# Altium schematic sheet RFID_DC_Motor_Stm32.SchDoc
size A4
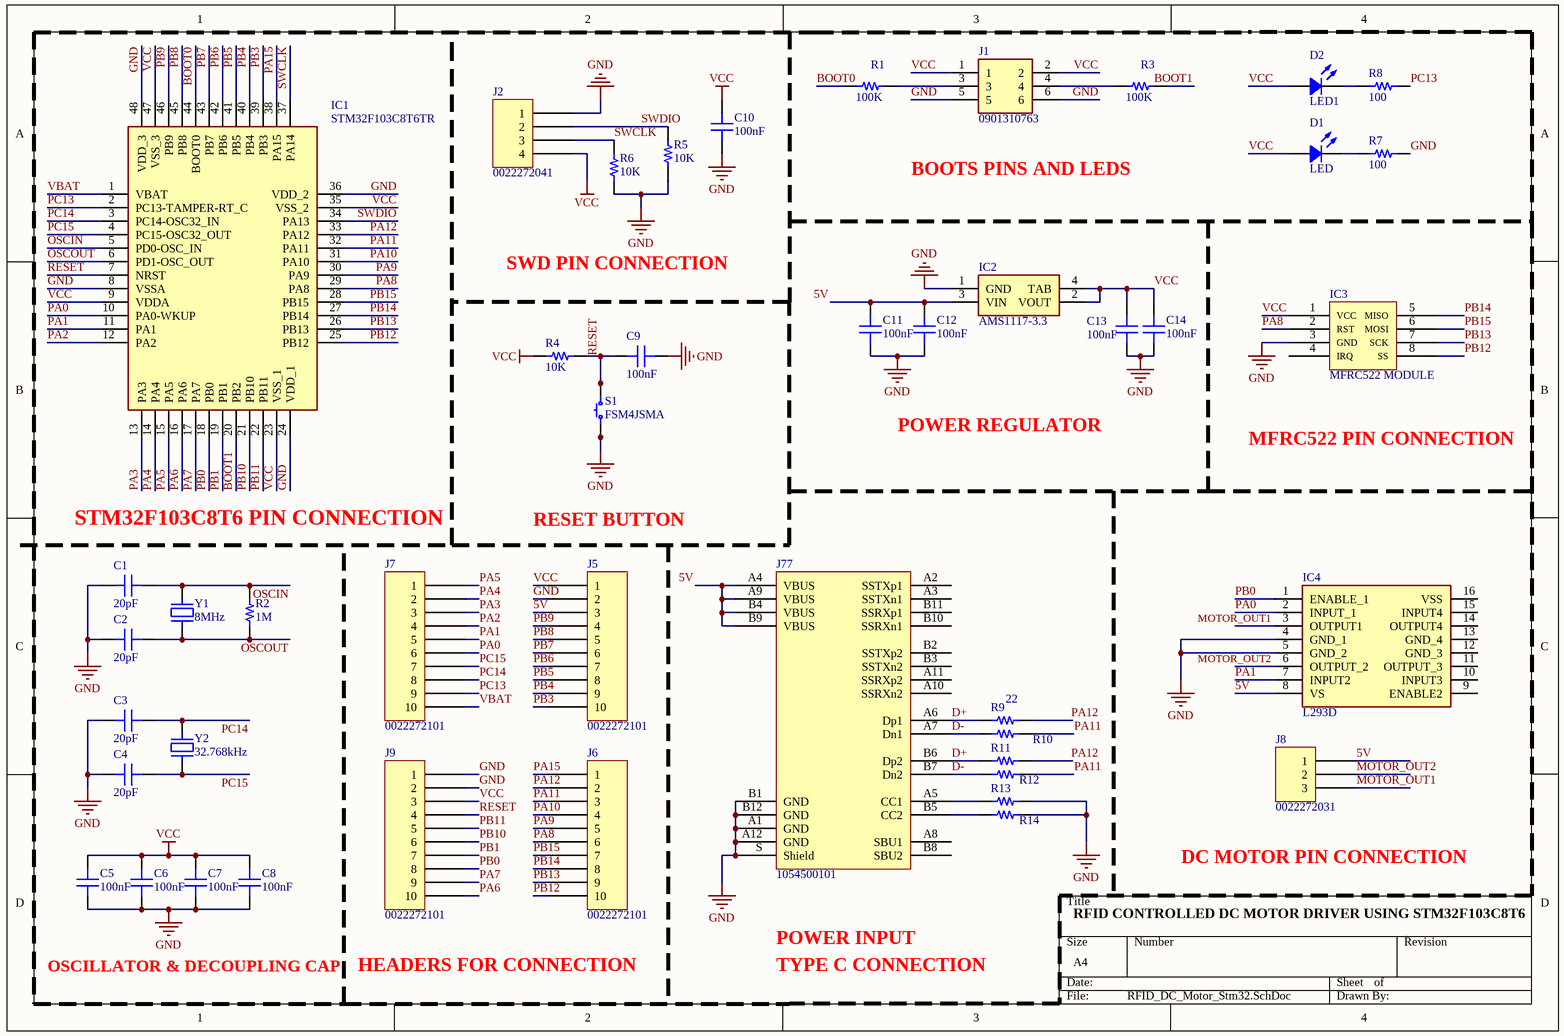
[diagram p0: RFID_DC_Motor_Stm32.SchDoc]

## Parts
C1  20pF  [CAP 0805_2012]
C2  20pF  [CAP 0805_2012]
C3  20pF  [CAP 0805_2012]
C4  20pF  [CAP 0805_2012]
C5  100nF  [CAP 0805_2012]
C6  100nF  [CAP 0805_2012]
C7  100nF  [CAP 0805_2012]
C8  100nF  [CAP 0805_2012]
C9  100nF  [CAP 0805_2012]
C10  100nF  [CAP 0805_2012]
C11  100nF  [CAP 0805_2012]
C12  100nF  [CAP 0805_2012]
C13  100nF  [CAP 0805_2012]
C14  100nF  [CAP 0805_2012]
D1  LED  [CREE J 2835]
D2  LED1  [CREE J 2835]
IC1  STM32F103C8T6TR  [QFP50P900X900X160-48N]
IC2  AMS1117-3.3  [SOT229P700X180-4N]
IC3  MFRC522 MODULE  [RC522]
IC4  L293D  [DIP880W50P254L2000H510Q16N]
J1  0901310763  [HDRV6W90P254_2X3_762X500X560P]
J2  0022272041  [MOLEX KK 0022272041]
J5  0022272101  [MOLEX KK 0022272101]
J6  0022272101  [MOLEX KK 0022272101]
J7  0022272101  [MOLEX KK 0022272101]
J8  0022272031  [MOLEX KK 0022272031]
J9  0022272101  [MOLEX KK 0022272101]
J77  1054500101  [Molex 1054500101]
R1  100K  [RES 0805_2012]
R2  1M  [RES 0805_2012]
R3  100K  [RES 0805_2012]
R4  10K  [RES 0805_2012]
R5  10K  [RES 0805_2012]
R6  10K  [RES 0805_2012]
R7  100  [RES 0805_2012]
R8  100  [RES 0805_2012]
R9  22  [RES 0805_2012]
R10  (no value)  [RES 0805_2012]
R11  (no value)  [RES 0805_2012]
R12  (no value)  [RES 0805_2012]
R13  (no value)  [RES 0805_2012]
R14  (no value)  [RES 0805_2012]
S1  FSM4JSMA  [TE FSM4JSMA]
Y1  8MHz  [ABRACON ABLS]
Y2  32.768kHz  [ABRACON ABS07]

## Nets
GND: C1.1 C2.1 C3.1 C4.1 C5.1 C6.1 C7.1 C8.1 C9.1 C10.1 C11.1 C12.1 C13.1 C14.1 IC1.8(VSSA) IC1.24(VDD_1) IC1.36(VDD_2) IC1.48(VDD_3) IC2.1(GND) IC3.3(GND) IC4.4(GND_1) IC4.5(GND_2) J1.5 J1.6 J2.1 J5.2 J9.1 J9.2 J77.A1(GND) J77.A12(GND) J77.B1(GND) J77.B12(GND) J77.S(Shield) R5.1 R6.2 R7.2 R13.1 R14.1 S1.1 S1.2
VCC: C5.2 C6.2 C7.2 C8.2 C10.2 C13.2 C14.2 D1.1 D2.1 IC1.9(VDDA) IC1.23(VSS_1) IC1.35(VSS_2) IC1.47(VSS_3) IC2.2(VOUT) IC2.4(TAB) IC3.1(VCC) J1.1 J1.2 J2.4 J5.1 J9.3 R4.2
5V: C11.2 C12.2 IC2.3(VIN) IC4.8(VS) J5.3 J8.1 J77.A4(VBUS) J77.A9(VBUS) J77.B4(VBUS) J77.B9(VBUS)
BOOT0: IC1.44(BOOT0) R1.1
BOOT1: IC1.20(PB2) R3.2
D+: J77.A6(Dp1) J77.B6(Dp2) R9.2 R11.2
D-: J77.A7(Dn1) J77.B7(Dn2) R10.2 R12.2
MOTOR_OUT1: IC4.3(OUTPUT1) J8.3
MOTOR_OUT2: IC4.6(OUTPUT_2) J8.2
OSCIN: C1.2 IC1.5(PD0-OSC_IN) R2.2 Y1.2
OSCOUT: C2.2 IC1.6(PD1-OSC_OUT) R2.1 Y1.1
PA0: IC1.10(PA0-WKUP) IC4.2(INPUT_1) J7.6
PA1: IC1.11(PA1) IC4.7(INPUT2) J7.5
PA2: IC1.12(PA2) J7.4
PA3: IC1.13(PA3) J7.3
PA4: IC1.14(PA4) J7.2
PA5: IC1.15(PA5) J7.1
PA6: IC1.16(PA6) J9.10
PA7: IC1.17(PA7) J9.9
PA8: IC1.29(PA8) IC3.2(RST) J6.6
PA9: IC1.30(PA9) J6.5
PA10: IC1.31(PA10) J6.4
PA11: IC1.32(PA11) J6.3 R10.1 R12.1
PA12: IC1.33(PA12) J6.2 R9.1 R11.1
PA15: IC1.38(PA15) J6.1
PB0: IC1.18(PB0) IC4.1(ENABLE_1) J9.8
PB1: IC1.19(PB1) J9.7
PB3: IC1.39(PB3) J5.10
PB4: IC1.40(PB4) J5.9
PB5: IC1.41(PB5) J5.8
PB6: IC1.42(PB6) J5.7
PB7: IC1.43(PB7) J5.6
PB8: IC1.45(PB8) J5.5
PB9: IC1.46(PB9) J5.4
PB10: IC1.21(PB10) J9.6
PB11: IC1.22(PB11) J9.5
PB12: IC1.25(PB12) IC3.8(SS) J6.10
PB13: IC1.26(PB13) IC3.7(SCK) J6.9
PB14: IC1.27(PB14) IC3.5(MISO) J6.8
PB15: IC1.28(PB15) IC3.6(MOSI) J6.7
PC13: IC1.2(PC13-TAMPER-RT_C) J7.9 R8.2
PC14: C3.2 IC1.3(PC14-OSC32_IN) J7.8 Y2.1
PC15: C4.2 IC1.4(PC15-OSC32_OUT) J7.7 Y2.2
RESET: C9.2 IC1.7(NRST) J9.4 R4.1 S1.3 S1.4
SWCLK: IC1.37(PA14) J2.3 R6.1
SWDIO: IC1.34(PA13) J2.2 R5.2
VBAT: IC1.1(VBAT) J7.10
NetD1_2: D1.2 R7.1
NetD2_2: D2.2 R8.1
NetJ1_3: J1.3 R1.2
NetJ1_4: J1.4 R3.1
NetJ77_A5: J77.A5(CC1) R13.2
NetJ77_B5: J77.B5(CC2) R14.2

Not connected (* = marked no-connect by the designer): IC3 4(IRQ); IC4 9(ENABLE2) 10(INPUT3) 11(OUTPUT_3) 12(GND_3) 13(GND_4) 14(OUTPUT4) 15(INPUT4) 16(VSS); J77 A2(SSTXp1) A3(SSTXn1) A8(SBU1) A10(SSRXn2) A11(SSRXp2) B2(SSTXp2) B3(SSTXn2) B8(SBU2) B10(SSRXn1) B11(SSRXp1)

## Notes on the sheet
- BOOTS PINS AND LEDS
- SWD PIN CONNECTION
- POWER REGULATOR
- MFRC522 PIN CONNECTION
- STM32F103C8T6 PIN CONNECTION
- RESET BUTTON
- RFID CONTROLLED DC MOTOR DRIVER USING STM32F103C8T6
- DC MOTOR PIN CONNECTION
- OSCILLATOR & DECOUPLING CAP
- HEADERS FOR CONNECTION
- TYPE C CONNECTION
- POWER INPUT

## Library data of the parts
C1-C14 = C0805C104M4VACTU: CAP CER 0.1UF 16V Y5V 0805; Manufacturer: KEMET; Capacitance: 0.1µF; Temperature Coefficient: Y5V (F); Tolerance: ±20%; Part Number: C0805C104M4VACTU; Applications: General Purpose; ComponentLink1Description: Datasheet; ComponentLink1URL: https://api.kemet.com/component-edge/download/datasheet/C0805C104M4VACTU.pdf; ComponentLink2Description: DigiKey Link; ComponentLink2URL: http://digikey.com/product-detail/en/kemet/C0805C104M4VACTU/399-9156-1-ND/3522674; Device Package: 0805 (2012 Metric); LastUpdated: 2.09.2020 01:04:38; Lifecycle Status: Active; Minimum Order: 1; Mounting Type: Surface Mount, MLCC; Operating Temperature: -30°C ~ 85°C; Package / Case: 0805 (2012 Metric); Packaging: TapeAndReel; PartId: 4429; Part Status: Active; Price: 0.02; Series: SMD Comm Y5V; Size / Dimension: 0.079" L x 0.049" W (2.00mm x 1.25mm); Supplier 1: DigiKey; Supplier Part Number 1: 399-9156-1-ND; Thickness (Max): 0.035" (0.88mm); Voltage - Rated: 16V
  C1-C4: Value: 20pF
  C5-C14: Value: 100nF
D1 D2 = JE2835AWT-R-U40GA0000-N0000001: LED WHITE  4000K JE2835 3V; Manufacturer: Cree Inc.; CCT (K): 4000K 3-Step MacAdam Ellipse; CRI (Color Rendering Index): 90; Current - Max: 240mA; Current - Test: 150mA; Flux @ 25°C, Current - Test: 62lm (Typ); Flux @ 85°C, Current - Test: 53lm (Typ); Lumens/Watt @ Current - Test: 140 lm/W; Viewing Angle: 120°; Voltage - Forward (Vf) (Typ): 2.95V; Part Number: JE2835AWT-R-U40GA0000-N0000001; ComponentLink1Description: Datasheet; ComponentLink1URL: https://www.cree.com/led-components/media/documents/data-sheet-JSeries-2835-3v.pdf; ComponentLink2Description: DigiKey Link; ComponentLink2URL: http://digikey.com/product-detail/en/cree-inc/JE2835AWT-R-U40GA0000-N0000001/2138-JE2835AWT-R-U40GA0000-N0000001CT-ND/10820356; Device Package: 1113 (2835 Metric); LastUpdated: 2.09.2020 01:30:24; Lifecycle Status: Active; Minimum Order: 1; Mounting Type: Surface Mount; Package / Case: 1113 (2835 Metric); Packaging: TapeAndReel; PartId: 58; Part Status: 1113 (2835 Metric); Price: 0.02; Series: J; Supplier 1: DigiKey; Supplier Part Number 1: 2138-JE2835AWT-R-U40GA0000-N0000001CT-ND; Supplier Device Package: SMD
IC1 = STM32F103C8T6TR: Integrated Circuit; Manufacturer_Name: STMicroelectronics; Datasheet Link: http://media.digikey.com/pdf/Data%20Sheets/ST%20Microelectronics%20PDFS/STM32F103x8,B.pdf; Height: 1.6mm; Manufacturer_Part_Number: STM32F103C8T6TR; Mouser Part Number: 511-STM32F103C8T6TR; Mouser Price/Stock: https://www.mouser.co.uk/ProductDetail/STMicroelectronics/STM32F103C8T6TR?qs=5HwTSiuA5HDxFj62n06yag%3D%3D; Arrow Part Number: STM32F103C8T6TR; Arrow Price/Stock: https://www.arrow.com/en/products/stm32f103c8t6tr/stmicroelectronics
IC2 = AMS1117-3.3: Integrated Circuit; Manufacturer_Name: Advanced Monolithic Systems; Datasheet Link: http://www.advanced-monolithic.com/pdf/ds1117.pdf; Height: 1.8mm; Manufacturer_Part_Number: AMS1117-3.3
IC3 = MFRC522 MODULE: RFID MODULE
IC4 = L293D: Integrated Circuit; Manufacturer_Name: STMicroelectronics; Datasheet Link: http://www.st.com/web/en/resource/technical/document/datasheet/CD00000059.pdf; Height: 5.1mm; Manufacturer_Part_Number: L293D; Mouser Part Number: 511-L293D; Mouser Price/Stock: https://www.mouser.co.uk/ProductDetail/STMicroelectronics/L293D/?qs=gr8Zi5OG3MgMJ1ICDzLQbg%3D%3D; Arrow Part Number: L293D; Arrow Price/Stock: https://www.arrow.com/en/products/l293d/stmicroelectronics
J1 = 0901310763: Connector; Manufacturer_Name: Molex; Datasheet Link: http://www.molex.com/pdm_docs/sd/901310763_sd.pdf; Height: 5.6mm; Manufacturer_Part_Number: 0901310763; Mouser Part Number: N/A; Mouser Price/Stock: https://www.mouser.co.uk/ProductDetail/Molex/0901310763?qs=PBcRNPEHKsoEorZjX1Xqdw%3D%3D; Arrow Part Number: 0901310763; Arrow Price/Stock: https://www.arrow.com/en/products/0901310763/molex
J2 = 0022272041: CONN HEADER VERT 4POS 2.54MM; Manufacturer: Molex; Contact Length - Mating: 0.295" (7.49mm); Contact Length - Post: 0.140" (3.56mm); Material Flammability Rating: UL94 V-0; Number of Positions: 4; Number of Positions Loaded: All; Overall Contact Length: 0.560" (14.22mm); Pitch - Mating: 0.100" (2.54mm); Shrouding: Shrouded - 1 Wall; Style: Board to Cable/Wire; Part Number: 0022272041; ComponentLink1Description: Datasheet; ComponentLink1URL: https://www.molex.com/pdm_docs/sd/022272041_sd.pdf; ComponentLink2Description: DigiKey Link; ComponentLink2URL: http://digikey.com/product-detail/en/molex/0022272041/WM4113-ND/1130579; Connector Type: Header; Contact Finish - Mating: Tin; Contact Finish - Post: Tin; Contact Finish Thickness - Mating: 100.0µin (2.54µm); Contact Material: Brass; Contact Shape: Square; Contact Type: Male Pin; Fastening Type: Friction Lock; Insulation Color: Natural; Insulation Height: 0.461" (11.70mm); Insulation Material: Polyamide (PA), Nylon; LastUpdated: 12.01.2020 23:52:05; Lifecycle Status: Active; Minimum Order: 1; Mounting Type: Through Hole; Number of Rows: 1; Packaging: Bulk; PartId: 78; Part Status: Active; Price: 0.40; Series: KK 6410; Supplier 1: DigiKey; Supplier Part Number 1: WM4113-ND; Termination: Solder
J5-J7 J9 = 0022272101: CONN HEADER VERT 10POS 2.54MM; Manufacturer: Molex; Contact Length - Mating: 0.295" (7.49mm); Contact Length - Post: 0.140" (3.56mm); Material Flammability Rating: UL94 V-0; Number of Positions: 10; Number of Positions Loaded: All; Overall Contact Length: 0.560" (14.22mm); Pitch - Mating: 0.100" (2.54mm); Shrouding: Shrouded - 1 Wall; Style: Board to Cable/Wire; Part Number: 0022272101; ComponentLink1Description: Datasheet; ComponentLink1URL: https://www.molex.com/pdm_docs/sd/022272101_sd.pdf; ComponentLink2Description: DigiKey Link; ComponentLink2URL: http://digikey.com/product-detail/en/molex/0022272101/WM4119-ND/1130585; Connector Type: Header; Contact Finish - Mating: Tin; Contact Finish - Post: Tin; Contact Finish Thickness - Mating: 100.0µin (2.54µm); Contact Material: Brass; Contact Shape: Square; Contact Type: Male Pin; Fastening Type: Friction Lock; Insulation Color: Natural; Insulation Height: 0.461" (11.70mm); Insulation Material: Polyamide (PA), Nylon; LastUpdated: 12.01.2020 23:53:02; Lifecycle Status: Active; Minimum Order: 1; Mounting Type: Through Hole; Number of Rows: 1; Packaging: Bulk; PartId: 84; Part Status: Active; Price: 0.73; Series: KK 6410; Supplier 1: DigiKey; Supplier Part Number 1: WM4119-ND; Termination: Solder
J8 = 0022272031: CONN HEADER VERT 3POS 2.54MM; Manufacturer: Molex; Contact Length - Mating: 0.295" (7.49mm); Contact Length - Post: 0.140" (3.56mm); Material Flammability Rating: UL94 V-0; Number of Positions: 3; Number of Positions Loaded: All; Overall Contact Length: 0.560" (14.22mm); Pitch - Mating: 0.100" (2.54mm); Shrouding: Shrouded - 1 Wall; Style: Board to Cable/Wire; Part Number: 0022272031; ComponentLink1Description: Datasheet; ComponentLink1URL: https://www.molex.com/pdm_docs/sd/022272031_sd.pdf; ComponentLink2Description: DigiKey Link; ComponentLink2URL: http://digikey.com/product-detail/en/molex/0022272031/WM4112-ND/1130578; Connector Type: Header; Contact Finish - Mating: Tin; Contact Finish - Post: Tin; Contact Finish Thickness - Mating: 100.0µin (2.54µm); Contact Material: Brass; Contact Shape: Square; Contact Type: Male Pin; Fastening Type: Friction Lock; Insulation Color: Natural; Insulation Height: 0.461" (11.70mm); Insulation Material: Polyamide (PA), Nylon; LastUpdated: 12.01.2020 23:51:54; Lifecycle Status: Active; Minimum Order: 1; Mounting Type: Through Hole; Number of Rows: 1; Packaging: Bulk; PartId: 77; Part Status: Active; Price: 0.37; Series: KK 6410; Supplier 1: DigiKey; Supplier Part Number 1: WM4112-ND; Termination: Solder
J77 = 1054500101: CONN RCP USB3.1 TYPEC 24P SMD RA; Manufacturer: Molex; Connector Type: USB - C (Type - C); Current Rating (Amps): 0.25A, 1A, 5A; Gender: Receptacle; Mating Cycles: 10000; Number of Contacts: 24; Number of Ports: 1; Shielding: Shielded; Specifications: USB 3.1 (USB 3.1 Gen 2, Superspeed+); Voltage - Rated: 30VAC/DC; Part Number: 1054500101; ComponentLink1Description: Datasheet; ComponentLink1URL: https://www.molex.com/pdm_docs/ps/PS-105448-001.pdf; ComponentLink2Description: DigiKey Link; ComponentLink2URL: http://digikey.com/product-detail/en/molex/1054500101/WM12856CT-ND/5843891; LastUpdated: 6.06.2020 02:14:04; Lifecycle Status: Active; Minimum Order: 1; Mounting Feature: Horizontal; Mounting Type: Surface Mount, Right Angle; Through Hole; Operating Temperature: -30°C ~ 85°C; Packaging: TapeAndReel; Part Status: Active; Price: 1.22; Series: 105445; Supplier 1: DigiKey; Supplier Part Number 1: WM12856CT-ND; Termination: Solder
R1-R14 = RMCF0805FT931K: RES 931K OHM 1% 1/8W 0805; Manufacturer: Stackpole Electronics Inc; Power (Watts): 0.125W, 1/8W; Resistance: 931 kOhms; Temperature Coefficient: ±100ppm/°C; Part Number: RMCF0805FT931K; ComponentLink1Description: Datasheet; ComponentLink1URL: https://www.seielect.com/catalog/sei-rmcf_rmcp.pdf; ComponentLink2Description: DigiKey Link; ComponentLink2URL: http://digikey.com/product-detail/en/stackpole-electronics-inc/RMCF0805FT931K/RMCF0805FT931KCT-ND/2418483; Composition: Thick Film; Device Package: 0805 (2012 Metric); Features: Automotive AEC-Q200; Height - Seated (Max): 0.026" (0.65mm); LastUpdated: 2.09.2020 01:15:05; Lifecycle Status: Active; Minimum Order: 1; Number of Terminations: 2; Operating Temperature: -55°C ~ 155°C; Package / Case: 0805 (2012 Metric); Packaging: CutTape; PartId: 36342; Part Status: Active; Price: 0.10; Ratings: AEC-Q200; Series: RMCF; Size / Dimension: 0.079" L x 0.049" W (2.00mm x 1.25mm); Supplier 1: DigiKey; Supplier Part Number 1: RMCF0805FT931KCT-ND; Supplier Device Package: 0805; Tolerance: ±1%
  R1 R3: Value: 100K
  R2: Value: 1M
  R4-R6: Value: 10K
  R7 R8: Value: 100
  R9: Value: 22
S1 = FSM4JSMA: SWITCH TACTILE SPST-NO 0.05A 24V; Manufacturer: TE Connectivity ALCOSWITCH Switches; Actuator Height off PCB, Vertical: 5.00mm; Actuator Orientation: Top Actuated; Actuator Type: Standard; Contact Rating @ Voltage: 0.05A @ 24VDC; Illumination: Non-Illuminated; Operating Force: 160gf; Outline: 6.00mm x 6.00mm; Switch Function: Off-Mom; Part Number: FSM4JSMA; Circuit: SPST-NO; ComponentLink1Description: Datasheet; ComponentLink1URL: https://www.te.com/commerce/DocumentDelivery/DDEController?Action=srchrtrv&DocNm=1308111-1_SWITCHES_CORE_PROGRAM_CATALOG&DocType=CS&DocLang=English; ComponentLink2Description: DigiKey Link; ComponentLink2URL: http://digikey.com/product-detail/en/te-connectivity-alcoswitch-switches/FSM4JSMA/450-1129-ND/525821; LastUpdated: 2.09.2020 01:27:07; Lifecycle Status: Active; Minimum Order: 1; Mounting Type: Surface Mount; Operating Temperature: -35°C ~ 85°C; Packaging: Bulk; Part Status: Active; Price: 0.23; Series: FSMJSMA; Supplier 1: DigiKey; Supplier Part Number 1: 450-1129-ND; Termination Style: Gull Wing
Y1 = ABLS-8.000MHZ-D-T: CRYSTAL 8.0000MHZ 18PF SMD; Manufacturer: Abracon LLC; ESR (Equivalent Series Resistance): 80 Ohms; Frequency Stability: ±50ppm; Operating Mode: Fundamental; Part Number: ABLS-8.000MHZ-D-T; ComponentLink1Description: Datasheet; ComponentLink1URL: https://abracon.com/Resonators/abls.pdf; ComponentLink2Description: DigiKey Link; ComponentLink2URL: http://digikey.com/product-detail/en/abracon-llc/ABLS-8.000MHZ-D-T/535-13445-2-ND/5980041; Frequency: 8MHz; Frequency Tolerance: ±50ppm; Height - Seated (Max): 0.165" (4.20mm); LastUpdated: 2.09.2020 01:21:45; Lifecycle Status: Active; Load Capacitance: 18pF; Minimum Order: 0; Mounting Type: Surface Mount; Operating Temperature: -40°C ~ 85°C; Package / Case: HC-49/US; Packaging: TapeAndReel; PartId: 98; Part Status: Active; Price: 0.18; Series: ABLS; Size / Dimension: 0.449" L x 0.185" W (11.40mm x 4.70mm); Supplier 1: DigiKey; Supplier Part Number 1: 535-13445-2-ND; Type: MHz Crystal; Value: 8MHz
Y2 = ABS07-32.768KHZ-9-1-T: CRYSTAL 32.768KHZ 9PF SMD; Manufacturer: Abracon LLC; ESR (Equivalent Series Resistance): 70 kOhms; Frequency Tolerance: ±10ppm; Operating Mode: Fundamental; Part Number: ABS07-32.768KHZ-9-1-T; ComponentLink1Description: Datasheet; ComponentLink1URL: https://abracon.com/Resonators/ABS07.pdf; ComponentLink2Description: DigiKey Link; ComponentLink2URL: http://digikey.com/product-detail/en/abracon-llc/ABS07-32.768KHZ-9-1-T/535-13479-1-ND/5980155; Frequency: 32.768kHz; Height - Seated (Max): 0.035" (0.90mm); LastUpdated: 2.09.2020 01:21:47; Lifecycle Status: Active; Load Capacitance: 9pF; Minimum Order: 0; Mounting Type: Surface Mount; Operating Temperature: -40°C ~ 85°C; Package / Case: 2-SMD, No Lead; Packaging: TapeAndReel; PartId: 380; Part Status: Active; Price: 0.55; Series: ABS07; Size / Dimension: 0.126" L x 0.059" W (3.20mm x 1.50mm); Supplier 1: DigiKey; Supplier Part Number 1: 535-13479-1-ND; Type: kHz Crystal (Tuning Fork); Value: 32.768kHz